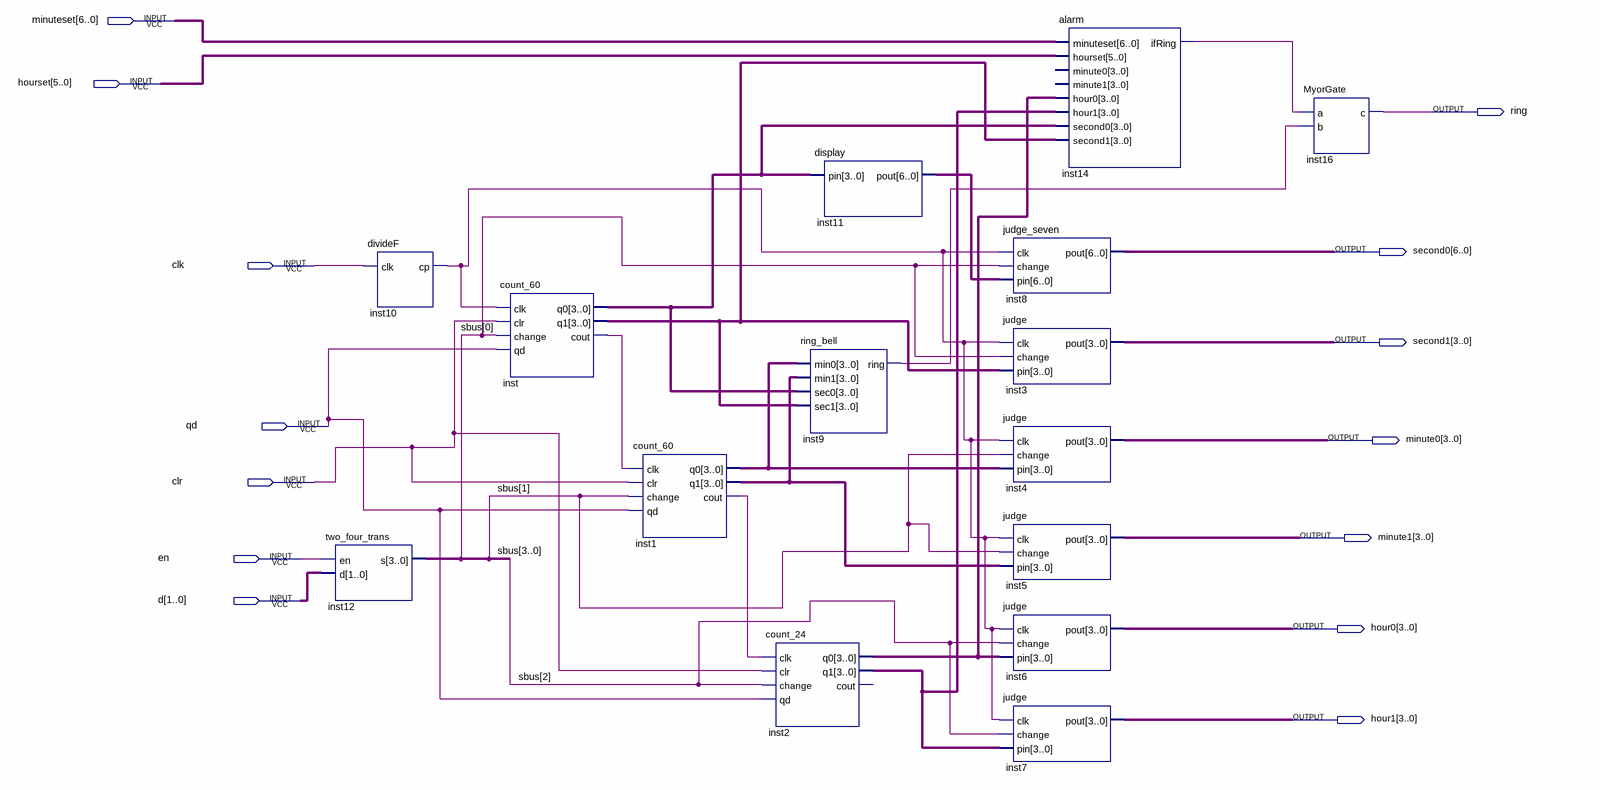
[diagram p0: schematic sheet]
// Quartus schematic total.bdf as structural Verilog: 15 symbols, 14 pins
module total (
  input  [6:0] minuteset,
  input  [5:0] hourset,
  input  clk,
  input  qd,
  input  clr,
  input  en,
  input  [1:0] d,
  output ring,
  output [6:0] second0,
  output [3:0] second1,
  output [3:0] minute0,
  output [3:0] minute1,
  output [3:0] hour0,
  output [3:0] hour1
);

  wire inst1_cout, inst9_ring, inst10_cp, inst14_ifring, inst_cout;
  wire [3:0] inst1_q0, inst1_q1, inst2_q0, inst2_q1, inst_q0, inst_q1, sbus;
  wire [6:0] inst11_pout;

  divideF inst10 (.clk(clk), .cp(inst10_cp));
  two_four_trans inst12 (.en(en), .d(d), .s(sbus));
  count_60 inst (.clk(inst10_cp), .clr(clr), .change(sbus[0]), .qd(qd), .q0(inst_q0), .q1(inst_q1), .cout(inst_cout));
  count_60 inst1 (
    .clk(inst_cout), .clr(clr), .change(sbus[1]), .qd(qd), .q0(inst1_q0), .q1(inst1_q1), .cout(inst1_cout));
  count_24 inst2 (.clk(inst1_cout), .clr(clr), .change(sbus[2]), .qd(qd), .q0(inst2_q0), .q1(inst2_q1));  // open: cout
  display inst11 (.pin(inst_q0), .pout(inst11_pout));
  ring_bell inst9 (.min0(inst1_q0), .min1(inst1_q1), .sec0(inst_q0), .sec1(inst_q1), .ring(inst9_ring));
  judge_seven inst8 (.clk(inst10_cp), .change(sbus[0]), .pin(inst11_pout), .pout(second0));
  judge inst3 (.clk(inst10_cp), .change(sbus[0]), .pin(inst_q1), .pout(second1));
  judge inst4 (.clk(inst10_cp), .change(sbus[1]), .pin(inst1_q0), .pout(minute0));
  judge inst5 (.clk(inst10_cp), .change(sbus[1]), .pin(inst1_q1), .pout(minute1));
  judge inst6 (.clk(inst10_cp), .change(sbus[2]), .pin(inst2_q0), .pout(hour0));
  judge inst7 (.clk(inst10_cp), .change(sbus[2]), .pin(inst2_q1), .pout(hour1));
  alarm inst14 (
    .minuteset(minuteset), .hourset(hourset), .hour0(inst2_q0), .hour1(inst2_q1), .second0(inst_q0),
    .second1(inst_q1), .ifRing(inst14_ifring));  // open: minute0, minute1
  MyorGate inst16 (.a(inst14_ifring), .b(inst9_ring), .c(ring));
endmodule
